# EAGLE schematic kicker v20 (EAGLE 9.7.0)
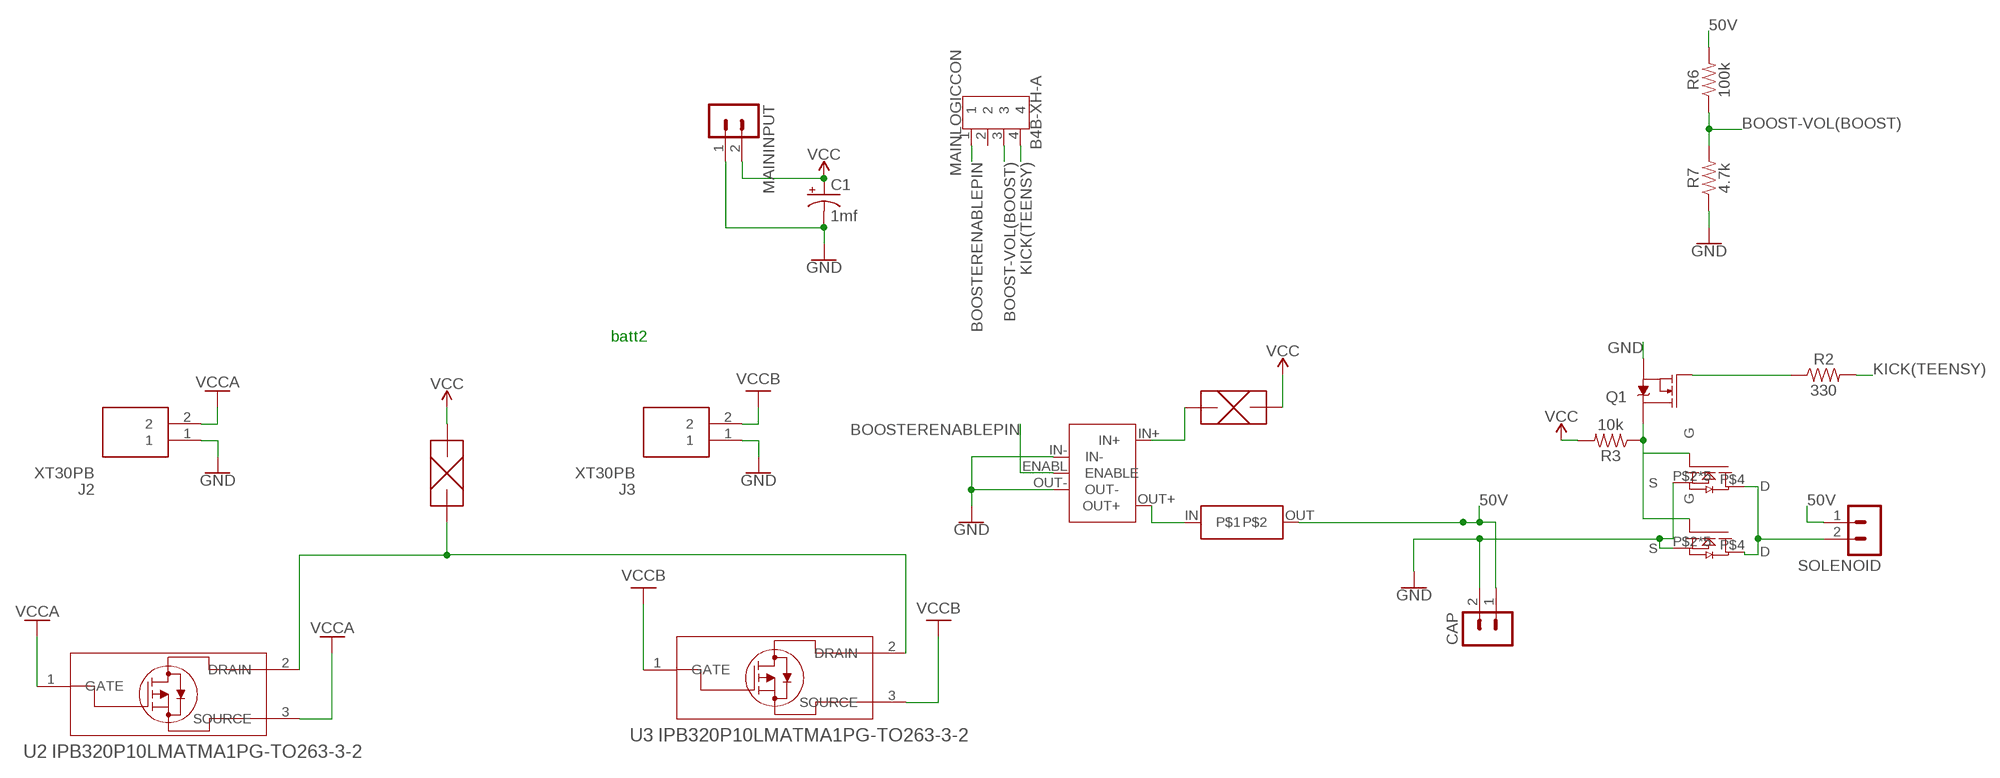
[diagram p0: schematic, sheet 1]

## Parts
C1  1mf  1000UF-RADIAL-5MM-35V-20%-KIT  [CPOL-RADIAL-5MM-10MM-KIT]
CAP  B2P-VH-FB-B  [B2P-VH-FB-B]
J2  XT30PB  [XT30PB]
J3  XT30PB  [XT30PB]
MAININPUT  B2P-VH-B  [B2P-VH]
MAINLOGICCON  B4B-XH-A  [B4B-XH-A]
Q1  5.8A/30V/35mΩ  MOSFET-NCH-AO3404A  [SOT23-3]
R2  330  330KOHM-0603-1/10W-1%  [0603]
R3  10k  10KOHM-0603-1/10W-1%  [0603]
R6  100k  10KOHM-0603-1/10W-1%  [0603]
R7  4.7k  10KOHM-0603-1/10W-1%  [0603]
SOLENOID  B2P-VH-FB-B  [B2P-VH-FB-B]
U2  IPB320P10LMATMA1PG-TO263-3-2  [PG-TO263-3-2]
U3  IPB320P10LMATMA1PG-TO263-3-2  [PG-TO263-3-2]
U$1  N-CH_D2PAK-7P  [D2PAK-7P]
U$2  N-CH_D2PAK-7P  [D2PAK-7P]
U$3  HPRE  [HPRE]
U$4  VOLTAGEBOOSTER  [VOLTAGEBOOSTER]
U$5  FUSE-HORIZONTAL  [MINI-RIGHT]
U$6  FUSE-HORIZONTAL  [MINI-RIGHT]

## Nets
50V: CAP.1 R6.2 SOLENOID.1 U$3.OUT
BOOST-VOL(BOOST): MAINLOGICCON.3 R6.1 R7.2
BOOSTERENABLEPIN: MAINLOGICCON.1 U$4.ENABL(ENABLE)
GND: C1.- CAP.2 J2.1 J3.1 MAININPUT.1 Q1.2(S) R7.1 U$1.P$2(S) U$1.P$3(S) U$1.P$5(S) U$1.P$6(S) U$1.P$7(S) U$2.P$2(S) U$2.P$3(S) U$2.P$5(S) U$2.P$6(S) U$2.P$7(S) U$4.IN- U$4.OUT-
KICK(TEENSY): MAINLOGICCON.4 R2.2
N$1: SOLENOID.2 U$1.P$4(D) U$2.P$4(D)
N$2: U$4.IN+ U$5.P$1 U$5.P$3
N$3: U$3.IN U$4.OUT+
N$4: Q1.3(D) R3.1 U$1.P$1(G) U$2.P$1(G)
N$5: Q1.1(G) R2.1
N$6: U2.2(DRAIN) U3.2(DRAIN) U$6.P$1 U$6.P$3
VCC: C1.+ MAININPUT.2 R3.2 U$5.P$2 U$5.P$4 U$6.P$2 U$6.P$4
VCCA: J2.2 U2.1(GATE) U2.3(SOURCE)
VCCB: J3.2 U3.1(GATE) U3.3(SOURCE)
Unconnected: MAINLOGICCON.2

## Notes on the sheet
- batt2

## Library data of the parts
C1 = SparkFun-Capacitors:1000UF: 1,000µF/1mF ceramic capacitors A capacitor is a passive two-terminal electrical component used to store electrical energy temporarily in an electric field. CAP-08070; PROD_ID: CAP-09538
CAP MAININPUT SOLENOID = con-JST VH:B2P-VH: JST VH Series header 3.96mm pitch disconnectable crimp style connectors, vertical (side entry type), 2 pins
J2 J3 = XT30PB:XT30PB: Mini XT60 XT30 Connector for RC Multirotor Racing Drone Quadcopter Source: Datasheet <https://www.tme.eu/Document/4acc913878197f8c2e30d4b8cdc47230/XT30UPB SPEC.pdf>; DESCRIPTION: Mini XT60 XT30 Connector for RC Multirotor Racing Drone Quadcopter; HEIGHT: 10.7mm; MANUFACTURER_NAME: Amass; MANUFACTURER_PART_NUMBER: XT30PB
MAINLOGICCON = Connector:B4B-XH-A: XH Connector Top Entry - 4POS Details see: Datasheet <http://www.jst-mfg.com/product/pdf/eng/eXH.pdf>; CATEGORY: Header; DSECRIPTION: Connector Header Through Hole 4 position 0.098" (2.50mm); MANUFACTURER: JST Sales America Inc.; MPN: B4B-XH-A(LF)(SN); OPERATING_TEMPERATURE: -25 C to 85 C; PART_STATUS: ACTIVE; PITCH: 0.098" (2.50mm); ROHS_COMPLIANCE: ROHS3 Compliant; SERIES: XH; SUB_CATEGORY: Rectangular Connectors; TYPE: Header, Male Pin, Board to Cable/Wire, Through Hole
Q1 = Semi:MOSFET-NCH: N-channel MOSFETs Voltage controlled devices that allow control of high current outputs. SparkFun Products: SparkFun OpenScale <https://www.sparkfun.com/products/13261> SparkFun Digital Sandbox <https://www.sparkfun.com/products/12651> SparkFun Monster Moto Shield <https://www.sparkfun.com/products/10182> SparkFun MOSFET Power Controller <https://www.sparkfun.com/products/11214>; PROD_ID: TRANS-12988
R2 = SparkFun-Resistors:330KOHM: 330kΩ resistor A resistor is a passive two-terminal electrical component that implements electrical resistance as a circuit element. Resistors act to reduce current flow, and, at the same time, act to lower voltage levels within circuits. - Wikipedia; PROD_ID: RES-08968; VALUE: 330k
R3 = SparkFun-Resistors:10KOHM: 10kΩ resistor A resistor is a passive two-terminal electrical component that implements electrical resistance as a circuit element. Resistors act to reduce current flow, and, at the same time, act to lower voltage levels within circuits. - Wikipedia; PROD_ID: RES-00824
R6 R7 = SparkFun-Resistors:10KOHM: 10kΩ resistor A resistor is a passive two-terminal electrical component that implements electrical resistance as a circuit element. Resistors act to reduce current flow, and, at the same time, act to lower voltage levels within circuits. - Wikipedia; PROD_ID: RES-00824; VALUE: 10k
U2 U3 = 2023-11-30_07-34-24_Library:IPB320P10LMATMA1; COPYRIGHT: Copyright (C) 2023 Ultra Librarian. All rights reserved.; DIGI-KEY_PART_NUMBER_1: 448-IPB320P10LMATMA1TR-ND; DIGI-KEY_PART_NUMBER_2: 448-IPB320P10LMATMA1CT-ND; DIGI-KEY_PART_NUMBER_3: 448-IPB320P10LMATMA1DKR-ND; MANUFACTURER_PART_NUMBER: IPB320P10LMATMA1; MFR_NAME: Infineon
U$1 U$2 = mosfet:N-CH_D2PAK-7P
U$3 = highpower resistor:HPRE
U$4 = Voltage Booster:VOLTAGEBOOSTER
U$5 U$6 = Right Fuse Holder:FUSE-HORIZONTAL